# Altium schematic sheet TP5100_Sch.SchDoc: TP5100 Layout, Cell Telemetry & ESP32 Integration
size A4; SheetNumber: 4; SheetTotal: 6
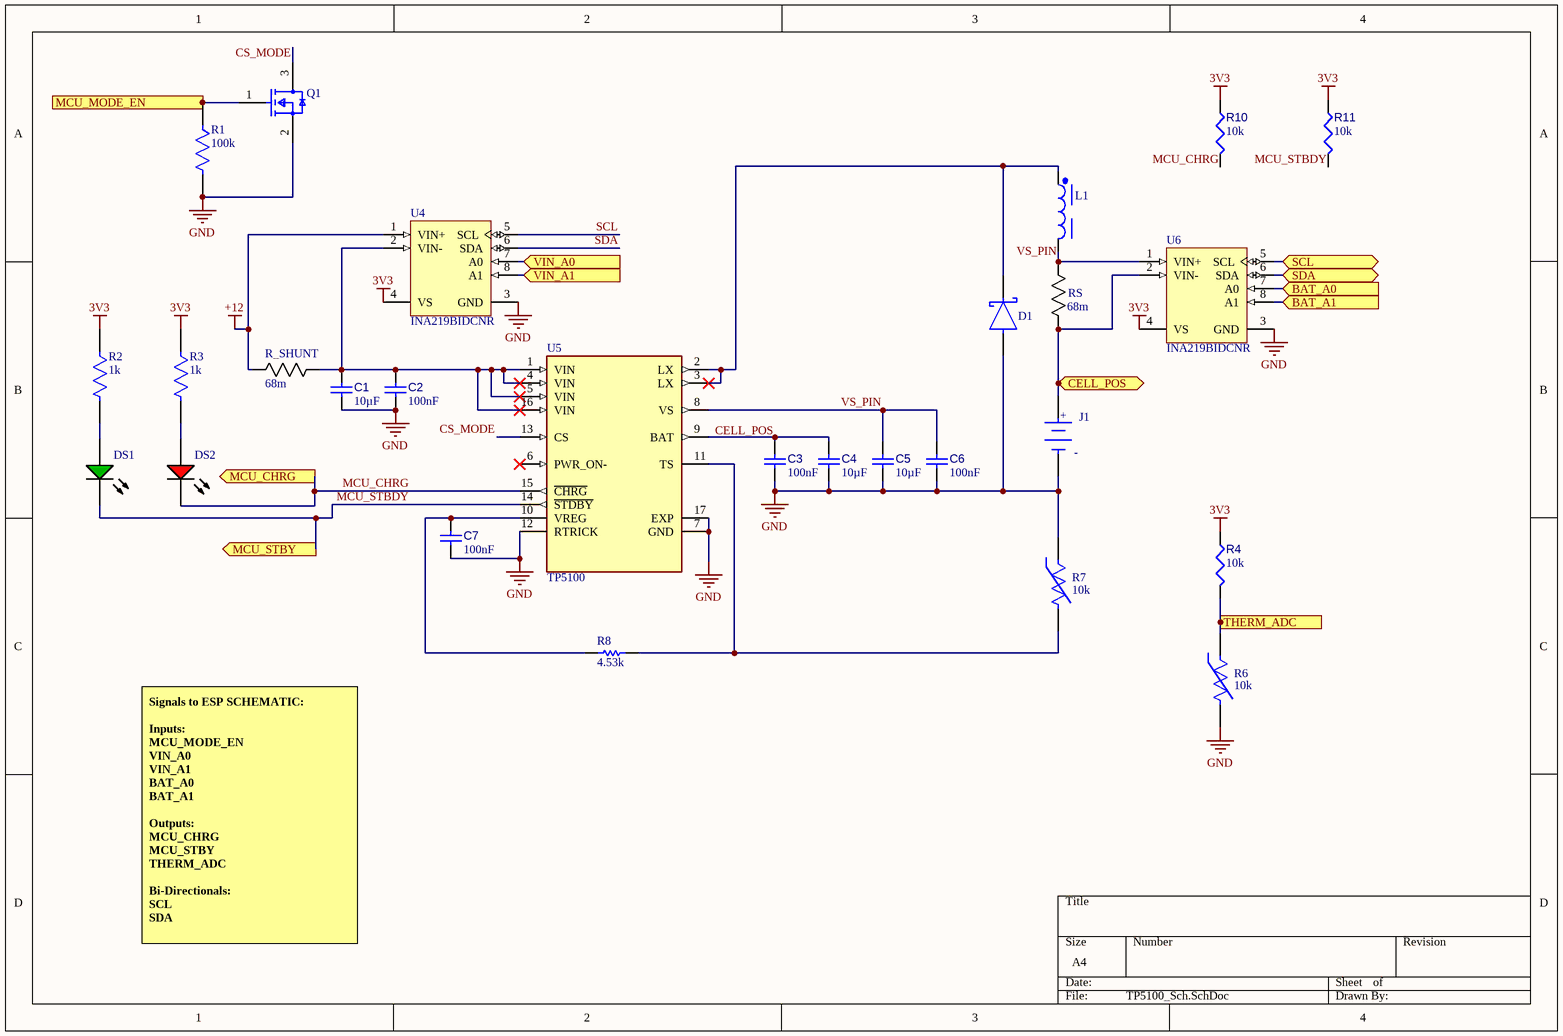
[diagram p0: TP5100_Sch.SchDoc]

## Parts
C1  value 10µF  [CAPC0402(1005)60_L]  (hidden comment: Capacitor 10µF +/-40% 6.3V 0402)
C2  value 100nF  [CAPC1005X56X25LL10T15]  (hidden comment: Capacitor 0.1 uF +/- 5% 16 V 0402)
C3  value 100nF  [CAPC1005X56X25LL10T15]  (hidden comment: Capacitor 0.1 uF +/- 5% 16 V 0402)
C4  value 10µF  [CAPC0402(1005)60_L]  (hidden comment: Capacitor 10µF +/-40% 6.3V 0402)
C5  value 10µF  [CAPC0402(1005)60_L]  (hidden comment: Capacitor 10µF +/-40% 6.3V 0402)
C6  value 100nF  [CAPC1005X56X25LL10T15]  (hidden comment: Capacitor 0.1 uF +/- 5% 16 V 0402)
C7  value 100nF  [CAPC1005X56X25LL10T15]  (hidden comment: Capacitor 0.1 uF +/- 5% 16 V 0402)
D1  SS34-E3/57T  [FP-95402-MFG]  (value not drawn)
DS1  LTL-1CHG  [LTST-LTL-1CHG-2]  (value not drawn)
DS2  WP7113SRD/D  [KING-WP7113SRDD_V]  (value not drawn)
J1  1043P  [FP-1043P-MFG]  (value not drawn)
L1  7447714220  [WE-PD_1050P]  (value not drawn)
Q1  2N7002H6327XTSA2  [FP-PG-SOT23-3-MFG]  (value not drawn)
R1  100k  [FP-RC0805-0_6-MFG]
R2  1k  [FP-RC0805-0_6-MFG]
R3  1k  [FP-RC0805-0_6-MFG]
R4  value 10k  [RESC0402(1005)_L]  (hidden comment: 10KR2F)
R6  10k  [FP-103AT-2-MFG]
R7  10k  [FP-103AT-2-MFG]
R8  4.53k  [RESC1608X55X25LL10T15]
R10  value 10k  [RESC0402(1005)_L]  (hidden comment: 10KR2F)
R11  value 10k  [RESC0402(1005)_L]  (hidden comment: 10KR2F)
R_SHUNT  68m  [YAG_R2512_YAG]
RS  68m  [YAG_R2512_YAG]
U4  INA219BIDCNR  [DCN0008A_M]
U5  TP5100  [QFN65P400X400X90-17N]
U6  INA219BIDCNR  [DCN0008A_M]

## Ports
BAT_A0 (in, see Main[1B]), BAT_A1 (in, see Main[1B]), CELL_POS (bidir), MCU_CHRG (out, see Main[2B]), MCU_MODE_EN (in, see Main[1B]), MCU_STBY (out, see Main[2B]), SCL (bidir, see Main[1B], ESP32_Sch[2B]), SDA (bidir, see Main[1B], ESP32_Sch[2B]), THERM_ADC (out, see Main[2B]), VIN_A0 (in, see Main[1B]), VIN_A1 (in, see Main[1B])

## Nets
3V3: R2.1 R3.1 R4.1 R10.1 R11.1 U4.4(VS) U6.4(VS)
+12: R_SHUNT.1 U4.1(VIN+)
GND: C1.2 C2.2 C3.2 C4.2 C5.2 C6.2 C7.2 D1.2(A) J1.1(C) Q1.2(source) R1.2 R6.2 R7.1 U4.3(GND) U5.7(GND) U5.12(RTRICK) U5.17(EXP) U6.3(GND)
BAT_A0: U6.7(A0) ; port BAT_A0
BAT_A1: U6.8(A1) ; port BAT_A1
CELL_POS: C3.1 C4.1 U5.9(BAT)
CELL_POS: J1.2(A) RS.2 U6.2(VIN-) ; port CELL_POS  [a separate net that carries the same name]
CS_MODE: Q1.3(drain) U5.13(CS)
MCU_CHRG: DS2.2(K) R10.2 U5.15(~{CHRG}) ; port MCU_CHRG
MCU_MODE_EN: Q1.1(gate) R1.1 ; port MCU_MODE_EN
MCU_STBDY: DS1.2(K) R11.2 U5.14(~{STDBY}) ; port MCU_STBY
SCL: U4.5(SCL)
SCL: U6.5(SCL) ; port SCL  [a separate net that carries the same name]
SDA: U4.6(SDA)
SDA: U6.6(SDA) ; port SDA  [a separate net that carries the same name]
THERM_ADC: R4.2 R6.1 ; port THERM_ADC
VIN_A0: U4.7(A0) ; port VIN_A0
VIN_A1: U4.8(A1) ; port VIN_A1
VS_PIN: C5.1 C6.1 L1.2 RS.1 U5.8(VS) U6.1(VIN+)
NetC1_1: C1.1 C2.1 R_SHUNT.2 U4.2(VIN-) U5.1(VIN) U5.4(VIN) U5.5(VIN) U5.16(VIN)
NetC7_1: C7.1 R8.1 U5.10(VREG)
NetD1_1: D1.1(C) L1.1 U5.2(LX) U5.3(LX)
NetDS1_1: DS1.1(A) R2.2
NetDS2_1: DS2.1(A) R3.2
NetR7_2: R7.2 R8.2 U5.11(TS)

Not connected (* = marked no-connect by the designer): U5 6(PWR_ON-)*

## Notes on the sheet
- Signals to ESP SCHEMATIC:
  Inputs:
  MCU_MODE_EN
  VIN_A0
  VIN_A1
  BAT_A0
  BAT_A1
  Outputs:
  MCU_CHRG
  MCU_STBY
  THERM_ADC
  Bi-Directionals:
  SCL
  SDA
- (in symbol CMP-19636-000034-1) +

## Library data of the parts
C1 C4 C5 = CMP-001-00074-3: Chip Capacitor, 10µF +/-40%, 6.3V, 0402, Thickness 0.6 mm; Tolerance: 10%; Case/Package: 0402; Pins: 2; Mounting Technology: SMT; Voltage Rating: 6.3V; Max Operating Temperature: 85°C; Min Operating Temperature: -55°C
C2 C3 C6 C7 = CMP-001-00001-6: Chip Capacitor, 0.1 uF, +/- 5%, 16 V, 0402 (1005 Metric); Capacitor Type: Ceramic; Voltage Rating: 16V; Max Operating Temperature: 125°C; Min Operating Temperature: -55°C; Case/Package: 0402; Mounting Technology: SM; Pins: 2; Tolerance: 5%; RoHS Compliant: True
D1 = CMP-02539-000012-1: DIODE SCHOTTKY 40V 3A DO214AB; Manufacturer: Vishay; Max Junction Temp: +150°C; Peak Reverse Current: 0.5mA; Max Surge Forward Current: 100A; Standoff Height: 0mm; ComponentLink2Description: Datasheet; Device Class L3: Schottky Diodes; Height: 2.62mm; Max Repetitive Reverse Voltage: 40V; Lead Free: Yes; Package: 95402; Temperature Range High: +150°C; ComponentLink2URL: http://www.vishay.com/docs/88751/ss32.pdf; Temperature: -55°C to +150°C; Footprint Url: http://www.vishay.com/docs/95402/smc.pdf; Automotive: No; Forward Current: 3A; Category: Diode; Manufacturer Part Number: SS34-E3/57T; RoHS: TRUE; Device Class L2: Diodes; Mouser Description: Schottky Diodes & Rectifiers 3.0 Amp 40 Volt; Octopart: https://octopart.com/ss34-e3%2F57t-vishay-39552907; Temperature Range Low: -55°C; Device Class L1: Discrete Semiconductors; Digikey Description: DIODE SCHOTTKY 40V 3A DO214AB
DS1 = CMP-007-00019-2: LED Uni-Color Green, 100 mW, 30 mA, -55 to 100 degC, 2-Pin THD, RoHS, Bulk; Manufacturer: Lite-On; Power: 100mW; Forward Voltage: 2.6V; Forward Current: 30mA; Nominal Vf: 2.1V; Lens Style: Dome; Viewing Angle: 60degrees; Luminous Intensity: 12.6mcd; Max Operating Temperature: 100°C; Case/Package: Radial; Package Reference: LTL-1CHG; Manufacturer URL: http://www.us.liteon.com/; Package Quantity: 1000; Colour: Green; Packaging: Bulk; RoHS Compliant: True; Datasheet URL: http://datasheet.octopart.com/LTL-1CHG-Lite-On-datasheet-143841.pdf; Package Description: 2-Pin Through Hole Device, Dia 3.8 mm; Min Operating Temperature: -55°C; Mounting Technology: TH; Pins: 2; Illumination Colour: Green; Datasheet Version: Mar-00
DS2 = CMP-007-00033-2: The Super Bright Red Source Color Device, 1.85 V, -40 to 85 degC, 2-Pin THD, RoHS, Tape and Reel; Manufacturer: Kingbright; Nominal Vf: 1.85V; Luminous Intensity: 300mcd; Viewing Angle: 30degrees; Lens Style: Diffused; RoHS Compliant: True; Datasheet Version: Rev. 6A, 07/2016; Illumination Colour: Red; Case/Package: Radial; Package Reference: WP7113SRDD; Package Quantity: 500; Datasheet URL: http://www.kingbrightusa.com/images/catalog/SPEC/WP7113SRD-D.pdf; Colour: Red; Packaging: Bulk; Forward Voltage: 1.85V; Mounting Technology: TH; Package Description: 2-Pin Through Hole Device, Dia 5.9 mm, Body Length 8.6 mm
J1 = CMP-19636-000034-1: BATT HOLDER 18650 1 CELL PC PIN; Number of Cells: 1; Series: -; Termination: PC Pin; Package Quantity: 50; Min Operating Temperature: -50°C; Mount: Through Hole; Packaging: Tray; Max Operating Temperature: 145°C
L1 = CMP-1396-00034-3: Inductor Power Shielded Wirewound 22uH 20% 100KHz Ferrite 3A 0.05Ohm DCR Automotive T/R; DC Resistance (DCR): 42mΩ; Saturation Current: 3.6A; Inductance: 22µH; Self Resonant Frequency: 14.5MHz; Series Resistance: 50mΩ; Composition: Wirewound; Ambient Temperature Range High: 110°C; Test Frequency: 100kHz; Inductance Tolerance: 20%; Case/Package: Nonstandard; Shielding: Shielded; Max DC Current: 3A; Ambient Temperature Range Low: -40°C; Height: 5mm; Current Rating: 3A; Termination: SMD/SMT; Core Material: Ferrite; Number of Pins: 2; Tolerance: 20%; Min Operating Temperature: -40°C; Depth: 10mm; Height - Seated (Max): 5.0038mm; Width: 10mm; Mount: Surface Mount; Length: 10mm; RoHS: Compliant; RMS Current (Irms): 3A; REACH SVHC: Unknown; Max Operating Temperature: 150°C
Q1 = CMP-32901-000180-1: MOSFET N-CH 60V 0.3A SOT23; Rise Time: 3.3ns; Input Capacitance: 20pF; Rds On Max: 3R; Gate to Source Voltage (Vgs): 20V; Continuous Drain Current (ID): 300mA; Max Power Dissipation: 500mW; Packaging: Tape and Reel; Mount: Surface Mount; Case/Package: SOT-23; Drain to Source Voltage (Vdss): 60V; Min Operating Temperature: -55°C; Halogen Free: Halogen Free; Max Dual Supply Voltage: 60V; Number of Pins: 3; Lead Free: Lead Free; Max Operating Temperature: 150°C
R1 = CMP-03412-037835-1: RC0805JR-07100KL, RES SMD 100K OHM 5% 1/8W 0805; Voltage Rating: 150V; Power Rating: 125mW; Temperature Coefficient: 100ppm/°C; Resistance: 100kR; Radiation Hardening: No; Lead Free: Lead Free; Size Code: 0805; Resistance Tolerance: 5%; Case Code (Imperial): 0805; Min Operating Temperature: -55°C; Packaging: Tape and Reel; Termination: SMD/SMT; Number of Terminations: 2; RoHS Compliant: Yes; Features: Moisture Resistant; Construction: Rectangular; Series: RC; Max Operating Temperature: 155°C; Military Standard: Not; Depth: 1.25mm; Contact Plating: Tin; Tolerance: 5%; Max Power Dissipation: 125mW; Length: 2mm; Case Code (Metric): 2012; Resistor Type: Thick Film; Case/Package: 0805
R2 R3 = CMP-03412-037820-1: RC0805JR-071KL, RES SMD 1K OHM 5% 1/8W 0805; Voltage Rating: 150V; Resistance: 1kR; Max Power Dissipation: 125mW; Temperature Coefficient: 100ppm/°C; Size Code: 0805; Series: RC; Number of Terminations: 2; Tolerance: 5%; Features: Moisture Resistant; Termination: SMD/SMT; Min Operating Temperature: -55°C; Construction: Rectangular; Lead Free: Lead Free; Contact Plating: Tin; Radiation Hardening: No; Packaging: Tape and Reel; Length: 2mm; Resistor Type: Thick Film; Military Standard: Not; Case Code (Metric): 2012; Depth: 1.25mm; Case Code (Imperial): 0805; Power Rating: 125mW; Max Operating Temperature: 155°C; Resistance Tolerance: 5%; RoHS Compliant: Yes; Case/Package: 0805
R4 R10 R11 = CMP-009-00066-2: 10K 0.063W 1% 0402 (1005 Metric)  SMD; Power: 63mW; Case/Package: 0402; Mounting Technology: SMT; Pins: 2; Tolerance: 1%
R6 R7 = CMP-2000-05824-2: 103AT-2, Thermistor NTC 10KOhm 1% 2-Pin; Resistance: 10kR; Lead Pitch: 2.54mm; Height: 2.4mm; Max Operating Temperature: 110°C; Width: 3.7mm; RoHS Compliant: Yes; Min Operating Temperature: -50°C; Termination: Radial; Packaging: Bulk; Number of Pins: 2; Series: AT; Tolerance: 1%; Length: 17mm
R8 = CMP-2000-04064-1: RC0603FR-074K53L; Manufacturer: Yageo; Part Number: RC0603FR-074K53L
R_SHUNT RS = CMP-009-00177-1: RL2512FK-070R068L; Manufacturer_Name: Yageo; Source: RL2512FK-070R068L.SchLib; Pins: 2; Design Item ID: RL2512FK-070R068L; Copyright: Copyright (C) 2026 Ultra Librarian. All rights reserved.; Manufacturer_Part_Number: RL2512FK-070R068L; Component Type: Standard
U4 U6 = CMP-0704-00043-2: Zero-Drift, Bi-Directional Current / Power Monitor, 3 to 5.5 V, -40 to 125 degC, 8-pin SOP (DCN8), Green (RoHS & no Sb/Br); Manufacturer: Texas Instruments; Gain(V/V): 1, 0.5, 0.25, 0.125; Vs(Min)(V): 3; Vs(Max)(V): 5.5; SubFamily: Current Shunt Monitor; Rating: Catalog; Small-Signal Bandwidth(Typ)(MHz): 0.011; Common Mode Range(Min)(V): 0; Quiescent Current (+/-)(Typ)(mA): 0.7; Input Offset (+/-)(Max)(uV): 50; Common Mode Range(Max)(V): 26; CMRR(Min)(dB): 100; DatasheetVersion: SBOS448F; ComponentLink2Description: Datasheet; PartNumber: INA219BIDCNR; ComponentLink3URL: http://www.ti.com/lit/ml/mpds099c/mpds099c.pdf; ComponentLink2URL: http://www.ti.com/general/docs/lit/getliterature.tsp?genericPartNumber=INA219&fileType=pdf; PackageDescription: 8-Pin Plastic Small Outline, Body 1.6 x 2.9 mm, Pitch 0.65 mm; PackageReference: DCN0008A; PackageVersion: 4202106/D, 11/2009; ComponentLink1Description: Manufacturer URL; ComponentLink3Description: Package Specification; Eco-Plan: Green (RoHS & no Sb/Br); ComponentLink1URL: http://www.ti.com/; Code_JEDEC: MO-178; Mounting Technology: Surface Mount
U5 = TP5100: 2A-switch buck 8.4V / 4.2V rechargeable lithium battery; MF: NanJing Top Power ASIC Corp.; Availability: Not in stock; MP: TP5100; Price: None; Value: *; SnapEDA_Link: https://www.snapeda.com/parts/TP5100/NanJing+Top+Power+ASIC+Corp./view-part/?ref=snap; Check_prices: https://www.snapeda.com/parts/TP5100/NanJing+Top+Power+ASIC+Corp./view-part/?ref=eda; Package: Package